# EAGLE design tic12400 (EAGLE 9.6.2)
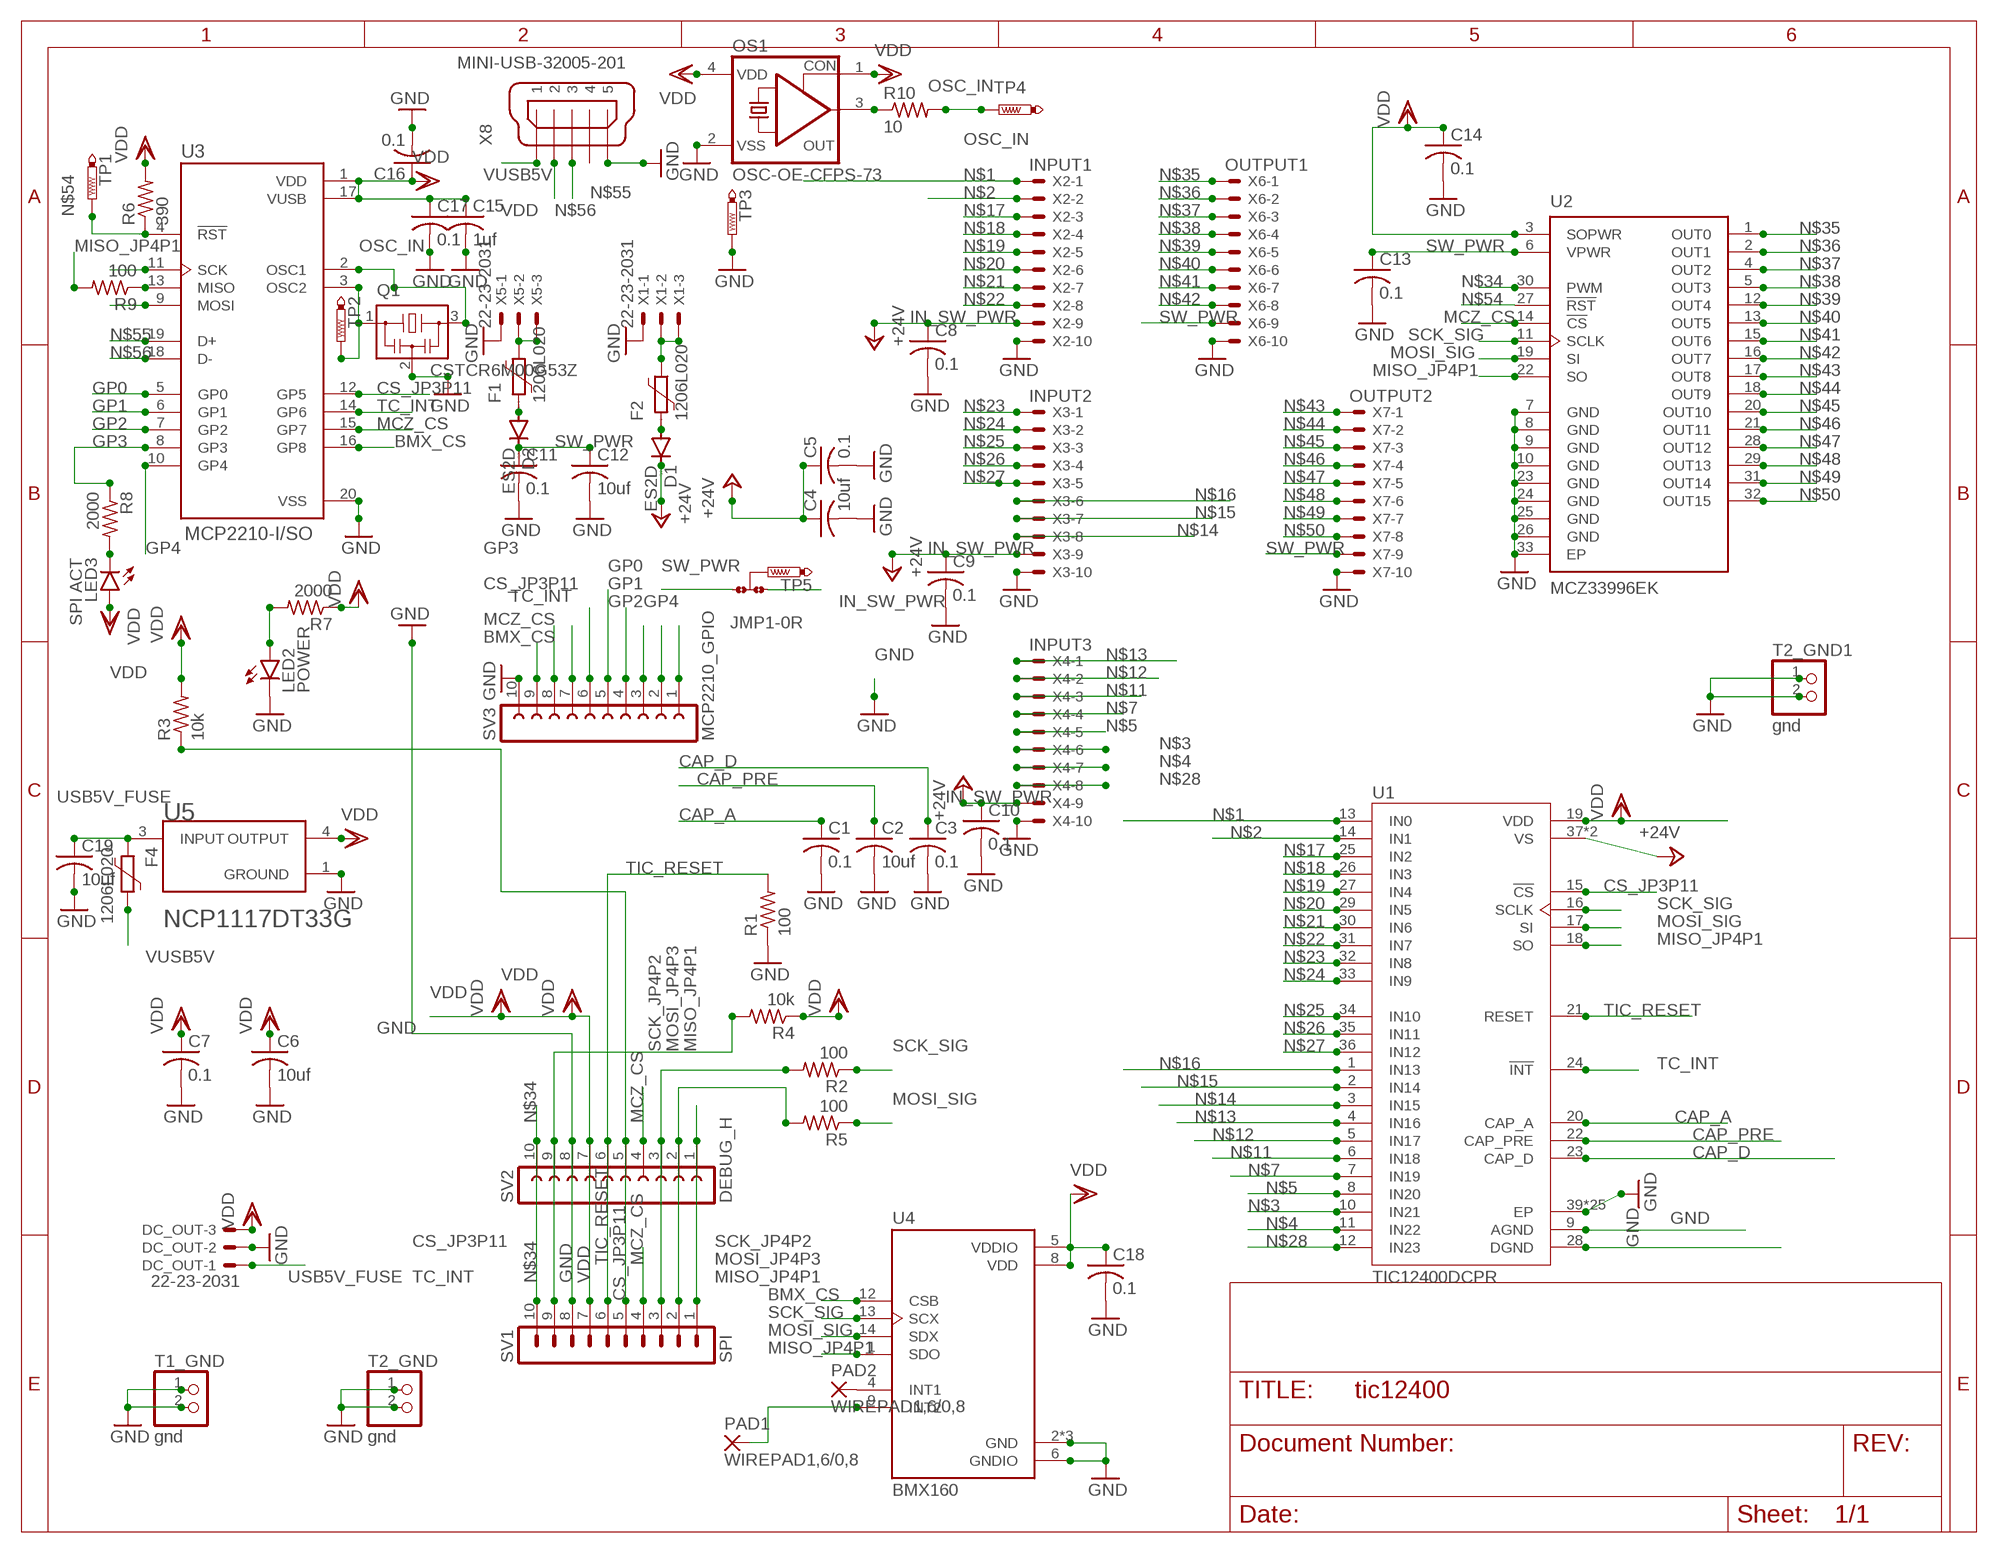
[diagram p0: schematic, sheet 1]

## Parts
C1  0.1  C-USC0805  [C0805]
C2  10uf  C-USC0805  [C0805]
C3  0.1  C-USC0805  [C0805]
C4  10uf  C-USC0805  [C0805]
C5  0.1  C-USC0805  [C0805]
C6  10uf  C-USC0805  [C0805]
C7  0.1  C-USC0805  [C0805]
C8  0.1  C-USC0805  [C0805]
C9  0.1  C-USC0805  [C0805]
C10  0.1  C-USC0805  [C0805]
C11  0.1  C-USC0805  [C0805]
C12  10uf  C-USC0805  [C0805]
C13  0.1  C-USC0805  [C0805]
C14  0.1  C-USC0805  [C0805]
C15  1uf  C-USC0805  [C0805]
C16  0.1  C-USC0805  [C0805]
C17  0.1  C-USC0805  [C0805]
C18  0.1  C-USC0805  [C0805]
C19  10uf  C-USC0805  [C0805]
D1  ES2D  [SMB]
D2  ES2D  [SMB]
DC_OUT  22-23-2031  [22-23-2031]
F1  1206L020  [1206L]
F2  1206L020  [1206L]
F4  1206L020  [1206L]
JMP1  +24_CONNECT  0R-JUMPA  [A0R-JMP]
LED2  POWER  LEDCHIP-LED0805  [CHIP-LED0805]
LED3  SPI ACT  LEDCHIP-LED0805  [CHIP-LED0805]
OS1  OSC-OE-CFPS-73  [7.2X5.2-4-PAD]
PAD1  WIREPAD1,6/0,8  [1,6/0,8]
PAD2  WIREPAD1,6/0,8  [1,6/0,8]
Q1  CSTCR6M00G53Z  [CSTCR6M]
R1  100  R-US_R0805  [R0805]
R2  100  R-US_R0805  [R0805]
R3  10k  R-US_R0805  [R0805]
R4  10k  R-US_R0805  [R0805]
R5  100  R-US_R0805  [R0805]
R6  390  R-US_R0805  [R0805]
R7  2000  R-US_R0805  [R0805]
R8  2000  R-US_R0805  [R0805]
R9  100  R-US_R0805  [R0805]
R10  10  R-US_R0805  [R0805]
SV1  SPI  MA10-1  [MA10-1]
SV2  DEBUG_H  FE10-1  [FE10]
SV3  MCP2210_GPIO  FE10-1  [FE10]
T1_GND  gnd  PINHD-1X2  [1X02]
T2_GND  gnd  PINHD-1X2  [1X02]
T2_GND1  gnd  PINHD-1X2  [1X02]
TP1  PTR1B1,27  [B1,27]
TP2  PTR1B1,27  [B1,27]
TP3  PTR1B1,27  [B1,27]
TP4  PTR1B1,27  [B1,27]
TP5  PTR1B1,27  [B1,27]
U1  TIC12400DCPR  [SOP50P640X120-38N]
U2  MCZ33996EK  [SOP65P1030X265-33N]
U3  MCP2210-I/SO  [SOP65P780X200-20N]
U4  BMX160  [PQFN50P250X300X100-14N]
U5  ON_SEMICONDUCTOR_NCP1117DT33GON_SEMICONDUCTOR_NCP1117DT33G_0_0  [ON_SEMICONDUCTOR_NCP1117DT33G_0]
X1  22-23-2031  [22-23-2031]
X2  INPUT1  KK-156-10  [KK-156-10]
X3  INPUT2  KK-156-10  [KK-156-10]
X4  INPUT3  KK-156-10  [KK-156-10]
X5  22-23-2031  [22-23-2031]
X6  OUTPUT1  KK-156-10  [KK-156-10]
X7  OUTPUT2  KK-156-10  [KK-156-10]
X8  MINI-USB-32005-201  [32005-201]

## Nets
BMX_CS: SV3.9 U3.16(GP8) U4.12(CSB)
CAP_A: C1.1 U1.20(CAP_A)
CAP_D: C3.1 U1.23(CAP_D)
CAP_PRE: C2.1 U1.22(CAP_PRE)
CS_JP3P11: R3.1 SV1.5 SV2.5 SV3.6 U1.15(!CS) U3.12(GP5)
GND [icurrent]: C1.2 C2.2 C3.2 C4.2 C5.2 C6.2 C7.2 C8.2 C9.2 C10.2 C11.2 C12.2 C13.2 C14.2 C15.2 C16.2 C17.2 C18.2 C19.2 DC_OUT.2 LED2.C OS1.2(VSS) Q1.2 R1.1 SV1.8 SV2.8 SV3.10 T1_GND.1 T1_GND.2 T2_GND1.1 T2_GND1.2 T2_GND.1 T2_GND.2 TP3.TP U1.9(AGND) U1.28(DGND) U1.39(EP) U1.40(EP) U1.41(EP) U1.42(EP) U1.43(EP) U1.44(EP) U1.45(EP) U1.46(EP) U1.47(EP) U1.48(EP) U1.49(EP) U1.50(EP) U1.51(EP) U1.52(EP) U1.53(EP) U1.54(EP) U1.55(EP) U1.56(EP) U1.57(EP) U1.58(EP) U1.59(EP) U1.60(EP) U1.61(EP) U1.62(EP) U1.63(EP) U2.7(GND) U2.8(GND) U2.9(GND) U2.10(GND) U2.23(GND) U2.24(GND) U2.25(GND) U2.26(GND) U2.33(EP) U3.20(VSS) U4.2(GND) U4.3(GND) U4.6(GNDIO) U4.7(GND) U5.1(GROUND) X1.1 X2.10 X3.10 X4.10 X5.1 X6.10 X7.10 X8.5
GP0: SV3.1 U3.5(GP0)
GP1: SV3.2 U3.6(GP1)
GP2: SV3.3 U3.7(GP2)
GP3: R8.1 SV3.4 U3.8(GP3)
GP4: SV3.5 U3.10(GP4)
IN_SW_PWR [icurrent]: C4.1 C5.1 C8.1 C9.1 C10.1 D1.C JMP1.3 U1.37(VS) U1.38(VS) X2.9 X3.9 X4.9 ; supply symbol labelled +24V
MCZ_CS: SV1.4 SV2.4 SV3.8 U2.14(!CS) U3.15(GP7)
MISO_JP4P1: R9.2 SV1.1 SV2.1 U1.18(SO) U2.22(SO) U4.1(SDO)
MOSI_JP4P3: R5.2 SV1.2 SV2.2
MOSI_SIG: R5.1 U1.17(SI) U2.19(SI) U3.9(MOSI) U4.14(SDX)
N$1: U1.13(IN0) X2.1
N$2: U1.14(IN1) X2.2
N$3: U1.10(IN21) X4.6
N$4: U1.11(IN22) X4.7
N$5: U1.8(IN20) X4.5
N$7: U1.7(IN19) X4.4
N$11: U1.6(IN18) X4.3
N$12: U1.5(IN17) X4.2
N$13: U1.4(IN16) X4.1
N$14: U1.3(IN15) X3.8
N$15: U1.2(IN14) X3.7
N$16: U1.1(IN13) X3.6
N$17: U1.25(IN2) X2.3
N$18: U1.26(IN3) X2.4
N$19: U1.27(IN4) X2.5
N$20: U1.29(IN5) X2.6
N$21: U1.30(IN6) X2.7
N$22: U1.31(IN7) X2.8
N$23: U1.32(IN8) X3.1
N$24: U1.33(IN9) X3.2
N$25: U1.34(IN10) X3.3
N$26: U1.35(IN11) X3.4
N$27: U1.36(IN12) X3.5
N$28: U1.12(IN23) X4.8
N$29 [icurrent]: F2.1 X1.2 X1.3
N$31 [icurrent]: D2.A F1.2
N$32 [icurrent]: F1.1 X5.2 X5.3
N$34: SV1.10 SV2.10 U2.30(PWM)
N$35 [icurrent]: U2.1(OUT0) X6.1
N$36 [icurrent]: U2.2(OUT1) X6.2
N$37 [icurrent]: U2.4(OUT2) X6.3
N$38 [icurrent]: U2.5(OUT3) X6.4
N$39 [icurrent]: U2.12(OUT4) X6.5
N$40 [icurrent]: U2.13(OUT5) X6.6
N$41 [icurrent]: U2.15(OUT6) X6.7
N$42 [icurrent]: U2.16(OUT7) X6.8
N$43 [icurrent]: U2.17(OUT8) X7.1
N$44 [icurrent]: U2.18(OUT9) X7.2
N$45 [icurrent]: U2.20(OUT10) X7.3
N$46 [icurrent]: U2.21(OUT11) X7.4
N$47 [icurrent]: U2.28(OUT12) X7.5
N$48 [icurrent]: U2.29(OUT13) X7.6
N$49 [icurrent]: U2.31(OUT14) X7.7
N$50 [icurrent]: U2.32(OUT15) X7.8
N$51 [icurrent]: D1.A F2.2
N$53: Q1.1 TP2.TP U3.3(OSC2)
N$54: R6.1 TP1.TP U2.27(!RST) U3.4(!RST)
N$55: U3.19(D+) X8.3
N$56: U3.18(D-) X8.2
N$58: LED2.A R7.2
N$59: LED3.C R8.2
N$66: R9.1 U3.13(MISO)
N$67: OS1.3(OUT) R10.1
N$68: JMP1.2 TP5.TP
N$70: PAD2.1(P) U4.4(INT1)
N$71: PAD1.1(P) U4.9(INT2)
OSC_IN: Q1.3 R10.2 TP4.TP U3.2(OSC1)
SCK_JP4P2: R2.2 SV1.3 SV2.3
SCK_SIG: R2.1 U1.16(SCLK) U2.11(SCLK) U3.11(SCK) U4.13(SCX)
SW_PWR [icurrent]: C11.1 C12.1 C13.1 D2.C JMP1.1 U2.6(VPWR) X6.9 X7.9
TC_INT: R4.2 SV1.9 SV2.9 SV3.7 U1.24(!INT) U3.14(GP6)
TIC_RESET: R1.2 SV1.6 SV2.6 U1.21(RESET)
USB5V_FUSE [icurrent]: C19.1 DC_OUT.1 F4.2 U5.3(INPUT)
VDD [icurrent]: C6.1 C7.1 C14.1 C15.1 C16.1 C17.1 C18.1 DC_OUT.3 LED3.A OS1.1(CON) OS1.4(VDD) R3.2 R4.1 R6.2 R7.1 SV1.7 SV2.7 U1.19(VDD) U2.3(SOPWR) U3.1(VDD) U3.17(VUSB) U4.5(VDDIO) U4.8(VDD) U5.4(OUTPUT)
VUSB5V: F4.1 X8.1
Unconnected: X8.4

## Library data of the parts
C1-C19 = rcl:C-US: CAPACITOR, American symbol; SPICEPREFIX: C
D1 D2 = diode:ES2D: DIODE super fast rectifier, 2 A
DC_OUT X1 X5 = con-molex:22-23-2031: .100" (2.54mm) Center Header - 3 Pin; MF: MOLEX; MPN: 22-23-2031; OC_FARNELL: 1462950; OC_NEWARK: 30C0862
F1 F2 F4 = polyfuse-smd_10:?: Polyfuse Resettable PTC Source: http://www.littelfuse.com/products/resettable-ptcs.aspx; MF: Littelfuse; MPN: 1206L020; OC_FARNELL: 2072173; OC_NEWARK: 05M2300
JMP1 = jump-0r-smd:0R-JUMP: SMD 0R 0805 Jumper
LED2 LED3 = led:LED: LED OSRAM: - CHIPLED LG R971, LG N971, LY N971, LG Q971, LY Q971, LO R971, LY R971 LH N974, LH R974 LS Q976, LO Q976, LY Q976 LO Q996 - Hyper CHIPLED LW Q18S LB Q993, LB Q99A, LB R99A - SideLED LS A670, LO A670, LY A670, LG A670, LP A670 LB A673, LV A673, LT A673, LW A673 LH A674 LY A675 LS A676, LA A676, LO A676, LY A676, LW A676 LS A679, LY A679, LG A679 - Hyper Micro SIDELED® LS Y876, LA Y876, LO Y876, LY Y876 LT Y87S - SmartLED LW L88C, LW L88S LB L89C, LB L89S, LG L890 LS L89K, LO L89K, LY L89K LS L896, LA L896, LO L896, LY L896 - TOPLED LS T670, LO T670, LY T670, LG T670, LP T670 LSG T670, LSP T670, LSY T670, LOP T670, LYG T670 LG T671, LOG T671, LSG T671 LB T673, LV T673, LT T673, LW T673 LH T674 LS T676, LA T676, LO T676, LY T676, LB T676, LH T676, LSB T676, LW T676 LB T67C, LV T67C, LT T67C, LS T67K, LO T67K, LY T67K, LW E67C LS E67B, LA E67B, LO E67B, LY E67B, LB E67C, LV E67C, LT E67C LW T67C LS T679, LY T679, LG T679 LS T770, LO T770, LY T770, LG T770, LP T770 LB T773, LV T773, LT T773, LW T773 LH T774 LS E675, LA E675, LY E675, LS T675 LS T776, LA T776, LO T776, LY T776, LB T776 LHGB T686 LT T68C, LB T68C - Hyper Mini TOPLED® LB M676 - Mini TOPLED Santana® LG M470 LS M47K, LO M47K, LY M47K Source: http://www.osram.convergy.de LUXEON: - LUMILED® LXK2-PW12-R00, LXK2-PW12-S00, LXK2-PW14-U00, LXK2-PW14-V00 LXK2-PM12-R00, LXK2-PM12-S00, LXK2-PM14-U00 LXK2-PE12-Q00, LXK2-PE12-R00, LXK2-PE12-S00, LXK2-PE14-T00, LXK2-PE14-U00 LXK2-PB12-K00, LXK2-PB12-L00, LXK2-PB12-M00, LXK2-PB14-N00, LXK2-PB14-P00, LXK2-PB14-Q00 LXK2-PR12-L00, LXK2-PR12-M00, LXK2-PR14-Q00, LXK2-PR14-R00 LXK2-PD12-Q00, LXK2-PD12-R00, LXK2-PD12-S00 LXK2-PH12-R00, LXK2-PH12-S00 LXK2-PL12-P00, LXK2-PL12-Q00, LXK2-PL12-R00 Source: www.luxeon.com KINGBRIGHT: KA-3528ASYC Source: www.kingbright.com
OS1 = IQD-Frequency-Products:OSC-OE: OSCILLATOR WITH OE
PAD1 PAD2 = wirepad:WIREPAD: Wire PAD connect wire on PCB
Q1 = murata-filter:CSTCR: Resonator Source: murata.co.jp; MPN: CSTCR6M00G53-R0; OC_FARNELL: 1170434; OC_NEWARK: 25M8759
R1-R10 = rcl:R-US_: RESISTOR, American symbol; SPICEPREFIX: R
SV1 = con-lstb:MA10-1: PIN HEADER; OC_FARNELL: unknown; OC_NEWARK: unknown
SV2 SV3 = con-lsta:FE10-1: FEMALE HEADER; OC_FARNELL: unknown; OC_NEWARK: unknown
T1_GND T2_GND T2_GND1 = pinhead:PINHD-1X2: PIN HEADER
TP1-TP5 = testpad:PTR1: TEST PIN
U1 = TIC12400DCPR:TIC12400DCPR: MSDI- PRODUCTION- COMMERCIAL VER; DESCRIPTION: 24-input sensor monitor with integrated 1:1 (SPST), 10-channel ADC & SPI 38-HTSSOP -40 to 105; DIGI-KEY_PART_NUMBER: 296-47492-1-ND; MF: Texas Instruments; MP: TIC12400DCPR; PACKAGE: HTSSOP-38 Texas Instruments; PURCHASE-URL: https://pricing.snapeda.com/search/part/TIC12400DCPR/?ref=eda
U2 = MCZ33996EK:MCZ33996EK: Power Switch Lo Side 0.9A Automotive 32-Pin SOIC W EP Tube Check prices <https://pricing.snapeda.com/parts/MCZ33996EK/NXP%20USA/view-part?ref=eda>; AVAILABILITY: In Stock; DESCRIPTION: Power Switch/Driver 1:16 N-Channel 900mA 32-SOIC-EP; MF: NXP USA; MP: MCZ33996EK; PACKAGE: SOIC-32 NXP Semiconductors; PRICE: None
U3 = MCP2210-I_SO:MCP2210-I/SO: MCP2210 Series 5.5 V 8 Channel USB to SPI Protocol Converter SMT - SSOP-20 Check prices <https://pricing.snapeda.com/parts/MCP2210-I/SO/Microchip%20Technology/view-part?ref=eda>; DESCRIPTION: USB to SPI Protocol Converter with GPIO SPI Interface 5V Automotive 20-Pin SOIC W Tube; MF: Microchip Technology; MP: MCP2210-I/SO; PACKAGE: None; PRICE: None
U4 = BMX160:BMX160: IMU ACCEL/GYRO/MAG Check prices <https://pricing.snapeda.com/parts/BMX160/Bosch%20Sensortec/view-part?ref=eda>; AVAILABILITY: Good; DESCRIPTION: Accelerometer, Gyroscope, Magnetometer, 9 Axis Sensor I²C, SPI Output; MF: Bosch Sensortec; MP: BMX160; PACKAGE: VFLGA-14 Bosch Sensortec; PRICE: None; PURCHASE-URL: https://pricing.snapeda.com/search/part/BMX160/?ref=eda
U5 = ON Semiconductor - NCP1117DT33G:ON_SEMICONDUCTOR_NCP1117DT33G: IC REG LINEAR 3.3V 1A DPAK; ACCURACY_PERCENTAGE: 1%; AMBIENT_TEMPERATURE_RANGE_HIGH: +125°C; AMBIENT_TEMPERATURE_RANGE_LOW: 0°C; AUTOMOTIVE: No; CENTROID_NOT_SPECIFIED: No; DATASHEET: https://www.onsemi.jp/PowerSolutions/document/NCP1117-D.PDF; DEVICE_CLASS_L1: Integrated Circuits (ICs); DEVICE_CLASS_L2: Power Management ICs; DEVICE_CLASS_L3: Voltage Regulators - Linear; DIGIKEY_DESCRIPTION: IC REG LINEAR 3.3V 1A DPAK; DIGIKEY_PART_NUMBER: NCP1117DT33GOS-ND; DROPOUT_VOLTAGE: 1.2V; FOOTPRINT_URL: https://www.onsemi.com/pub/Collateral/369C.PDF; FOOTPRINT_VARIANT_NAME_0: Recommended_Land_Pattern; HEIGHT: 2.51mm; LEAD_FREE: Yes; MAX_JUNCTION_TEMP: +150°C; MAX_SUPPLY_VOLTAGE: 20V; MF: ON Semiconductor; MFG_PACKAGE_IDENT: 369C; MFG_PACKAGE_IDENT_DATE: 07/2015; MFG_PACKAGE_IDENT_REV: F; MIN_SUPPLY_VOLTAGE: 2.4V; MOUSER_DESCRIPTION: LDO Voltage Regulators 3.3V 1A Positive; MOUSER_PART_NUMBER: 863-NCP1117DT33G; MPN: NCP1117DT33G; NOMINAL_SUPPLY_CURRENT: 6mA; NUMBER_OF_OUTPUTS: 1; OUTPUT_CURRENT: 1A; OUTPUT_TYPE: Fixed; OUTPUT_VOLTAGE: 3.3V; PACKAGE: DPAK; PREFIX: U; ROHS: Yes; STANDOFF_HEIGHT: 0mm; TEMPERATURE_RANGE_HIGH: +150°C; TEMPERATURE_RANGE_LOW: -55°C; VERIFICATION_VERSION: 0.0.0.3
X2-X4 X6 X7 = con-molex:KK-156-10: KK 156 HEADER Source: http://www.molex.com/pdm_docs/sd/026604100_sd.pdf; MF: MOLEX; OC_FARNELL: unknown; OC_NEWARK: unknown
X8 = con-cypressindustries:MINI-USB-: MINI USB-B Conector Source: www.cypressindustries.com; OC_FARNELL: unknown; OC_NEWARK: unknown

## Net classes
1 icurrent: width 0.254 mm

## Board
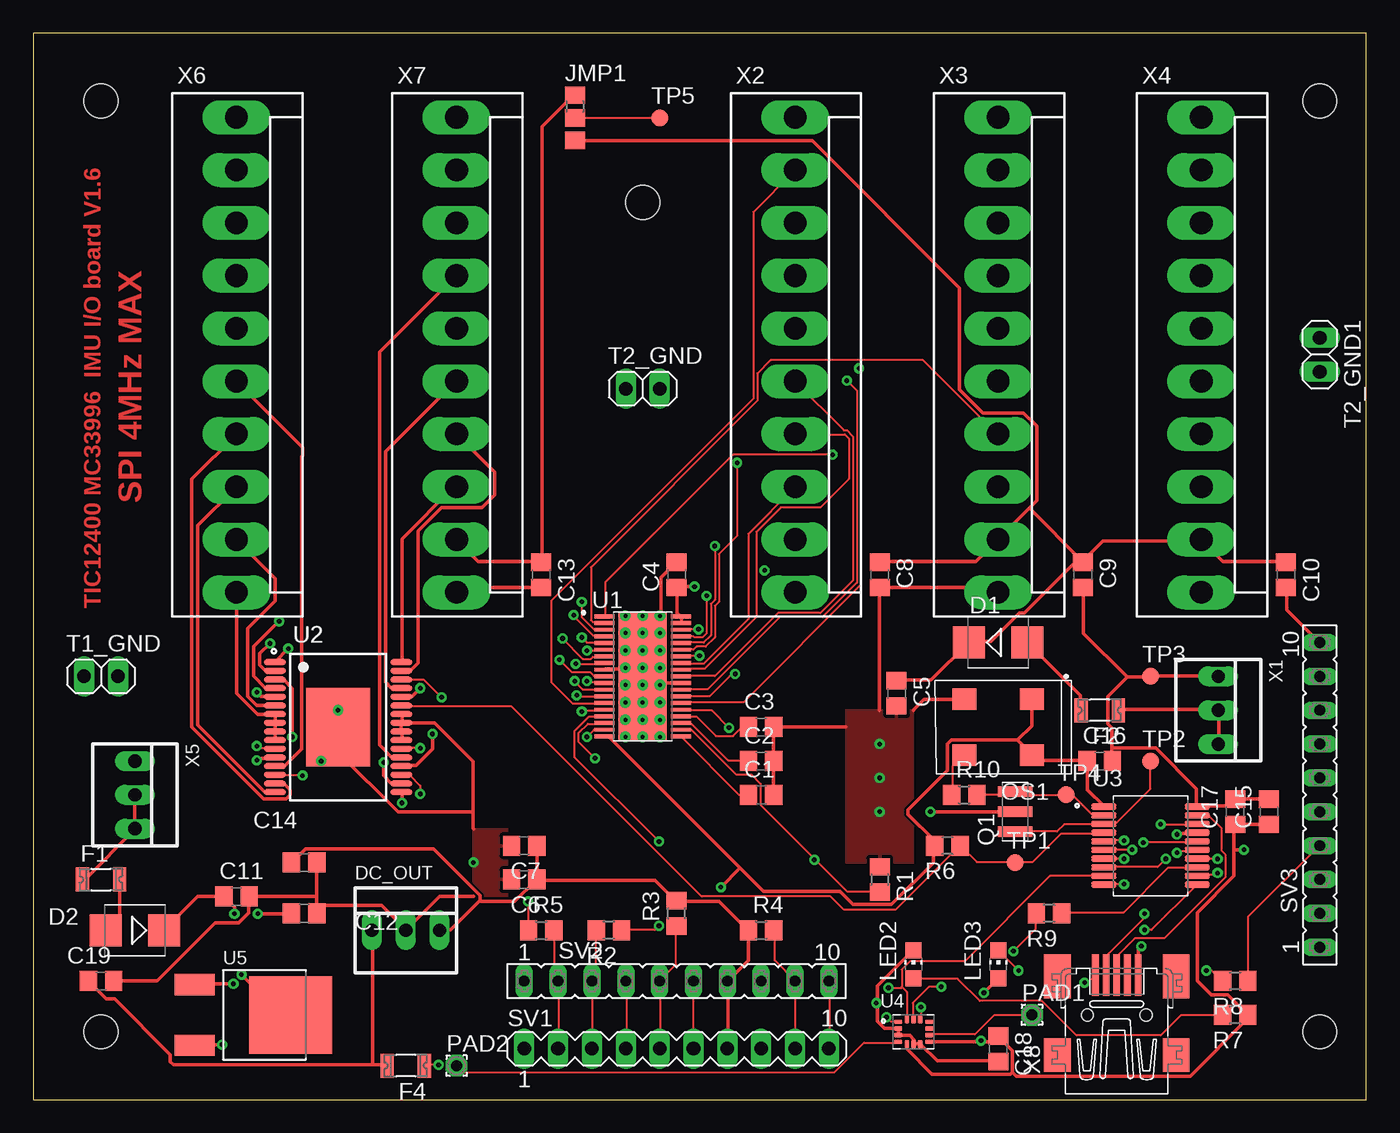
[diagram p1: board, top side]
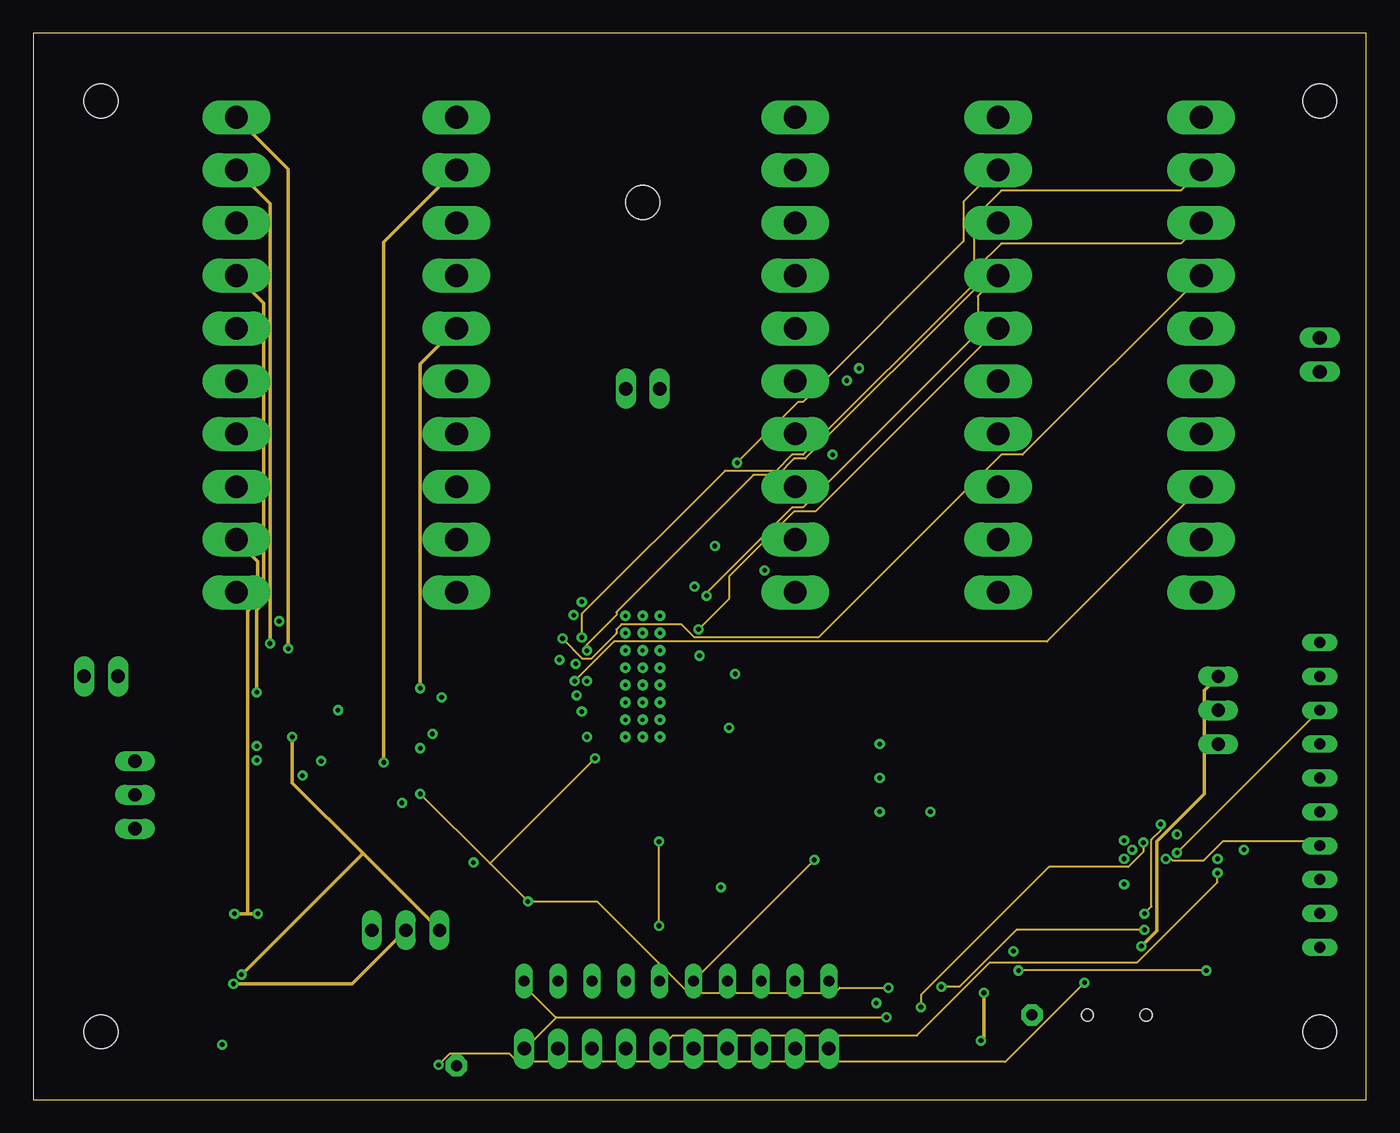
[diagram p2: board, inner layer Route2]
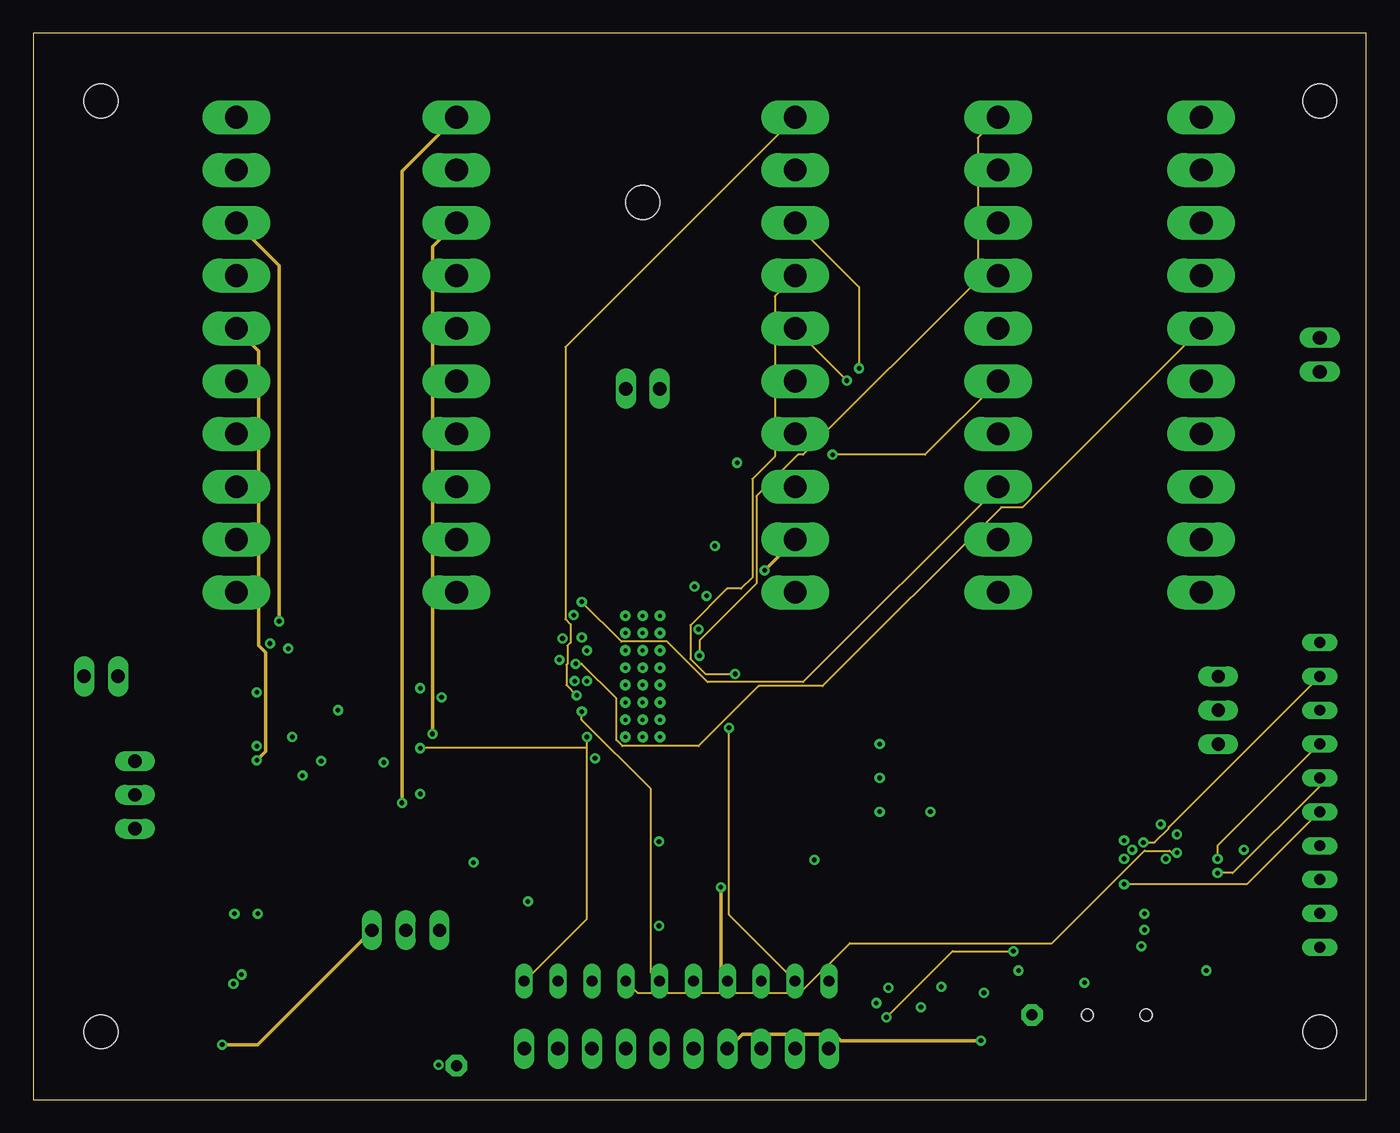
[diagram p3: board, inner layer Route15]
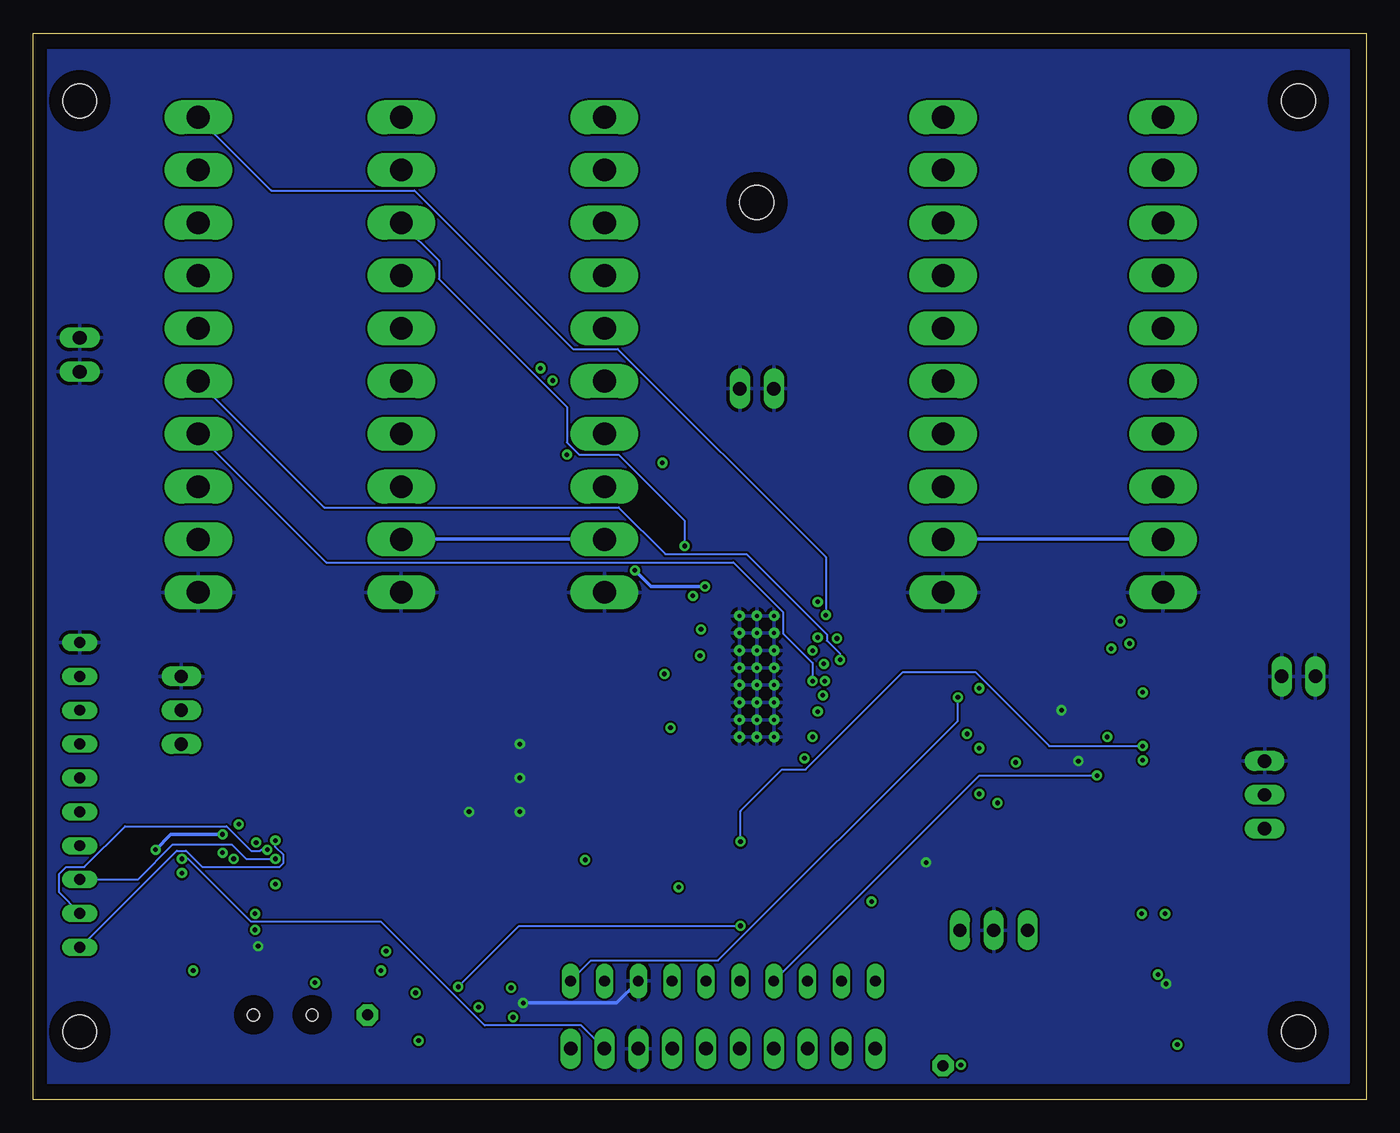
[diagram p4: board, bottom side, seen from below]

Size 100 x 80 mm. Coordinates in mm from the lower left corner, seen from the top.
Outline: 0,0 100,0 100,80 0,80 0,0
Copper layers (1+2*15+16): Top 0.035mm / dielectric 1.5mm / Route2 0.035mm / dielectric 0.15mm / Route15 0.035mm / dielectric 0.2mm / Bottom 0.035mm
Design rules "default *": minimum track width 6mil, minimum drill 0.35mm, track to track 6mil, track to pad 6mil, pad to pad 6mil, via to via 6mil, smd to smd 6mil, copper to edge 40mil, drill to drill 6mil, minimum pad ring 10mil, minimum via ring 8mil, stop-mask expansion 4mil, vias tented up to drill 0mil, thermal gap 10mil
Holes 2.54 mm at 5.08,74.93 5.08,5.08 96.52,5.08 96.52,74.93 45.72,67.31

### Footprints (pad centres in the part's own frame; a part is rotated, then mirrored left to right if it is on the bottom)
C0805 = smd 1.3 x 1.5: 1 -0.95,0; 2 0.95,0
SMB = smd 2.4 x 2.4: A 2.2,0; C -2.2,0
22-23-2031 = drill 1 long: 1 -2.54,0; 2 0,0; 3 2.54,0
1206L = smd 1 x 1.8: 1 -1.4,0; 2 1.4,0
A0R-JMP = smd 1.5 x 1.3: 1 0,1.7; 2 0,0; 3 0,-1.7
CHIP-LED0805 = smd 1.2 x 1.2: A 0,-1.05; C 0,1.05
7.2X5.2-4-PAD = smd 1.8 x 1.6: 1 -2.54,-2.1; 2 2.54,-2.1; 3 2.54,2.1; 4 -2.54,2.1
1,6/0,8 = drill 0.813 pad 1.6 octagon: 1 0,0
CSTCR6M = smd 0.8 x 2.6: 1 -1.5,0; 2 0,0; 3 1.5,0
R0805 = smd 1.3 x 1.5: 1 -0.95,0; 2 0.95,0
MA10-1 = drill 1.016 long: 1 -11.43,0; 2 -8.89,0; 3 -6.35,0; 4 -3.81,0; 5 -1.27,0; 6 1.27,0; 7 3.81,0; 8 6.35,0; 9 8.89,0; 10 11.43,0
FE10 = drill 0.813 long: 1 -11.43,0; 2 -8.89,0; 3 -6.35,0; 4 -3.81,0; 5 -1.27,0; 6 1.27,0; 7 3.81,0; 8 6.35,0; 9 8.89,0; 10 11.43,0
1X02 = drill 1.016 long: 1 -1.27,0; 2 1.27,0
B1,27 = smd 1.27 x 1.27: TP 0,0
SOP50P640X120-38N = smd 1.57 x 0.28: 1 -2.87,4.5; 2 -2.87,4; 3 -2.87,3.5; 4 -2.87,3; 5 -2.87,2.5; 6 -2.87,2; 7 -2.87,1.5; 8 -2.87,1; 9 -2.87,0.5; 10 -2.87,0; 11 -2.87,-0.5; 12 -2.87,-1; 13 -2.87,-1.5; 14 -2.87,-2; 15 -2.87,-2.5; 16 -2.87,-3; 17 -2.87,-3.5; 18 -2.87,-4; 19 -2.87,-4.5; 20 2.87,-4.5; 21 2.87,-4; 22 2.87,-3.5; 23 2.87,-3; 24 2.87,-2.5; 25 2.87,-2; 26 2.87,-1.5; 27 2.87,-1; 28 2.87,-0.5; 29 2.87,0; 30 2.87,0.5; 31 2.87,1; 32 2.87,1.5; 33 2.87,2; 34 2.87,2.5; 35 2.87,3; 36 2.87,3.5; 37 2.87,4; 38 2.87,4.5 | smd 3.6 x 9.7: 39 0,0 | drill 0.3 pad 0.5: 40 -1.3,4.55; 41 0,4.55; 42 1.3,4.55; 43 -1.3,3.25; 44 0,3.25; 45 1.3,3.25; 46 -1.3,1.95; 47 0,1.95; 48 1.3,1.95; 49 -1.3,0.65; 50 0,0.65; 51 1.3,0.65; 52 -1.3,-0.65; 53 0,-0.65; 54 1.3,-0.65; 55 -1.3,-1.95; 56 0,-1.95; 57 1.3,-1.95; 58 -1.3,-3.25; 59 -1.3,-4.55; 60 0,-3.25; 61 0,-4.55; 62 1.3,-3.25; 63 1.3,-4.55
SOP65P1030X265-33N = smd 1.65 x 0.45: 1 -4.75,4.875; 2 -4.75,4.225; 3 -4.75,3.575; 4 -4.75,2.925; 5 -4.75,2.275; 6 -4.75,1.625; 7 -4.75,0.975; 8 -4.75,0.325; 9 -4.75,-0.325; 10 -4.75,-0.975; 11 -4.75,-1.625; 12 -4.75,-2.275; 13 -4.75,-2.925; 14 -4.75,-3.575; 15 -4.75,-4.225; 16 -4.75,-4.875; 17 4.75,-4.875; 18 4.75,-4.225; 19 4.75,-3.575; 20 4.75,-2.925; 21 4.75,-2.275; 22 4.75,-1.625; 23 4.75,-0.975; 24 4.75,-0.325; 25 4.75,0.325; 26 4.75,0.975; 27 4.75,1.625; 28 4.75,2.275; 29 4.75,2.925; 30 4.75,3.575; 31 4.75,4.225; 32 4.75,4.875 | smd 4.8 x 5.9: 33 0,0
SOP65P780X200-20N = smd 1.9 x 0.48: 1 -3.505,2.925; 2 -3.505,2.275; 3 -3.505,1.625; 4 -3.505,0.975; 5 -3.505,0.325; 6 -3.505,-0.325; 7 -3.505,-0.975; 8 -3.505,-1.625; 9 -3.505,-2.275; 10 -3.505,-2.925; 11 3.505,-2.925; 12 3.505,-2.275; 13 3.505,-1.625; 14 3.505,-0.975; 15 3.505,-0.325; 16 3.505,0.325; 17 3.505,0.975; 18 3.505,1.625; 19 3.505,2.275; 20 3.505,2.925
PQFN50P250X300X100-14N = smd 0.58 x 0.35: 1 -1.16,0.75; 2 -1.16,0.25; 3 -1.16,-0.25; 4 -1.16,-0.75; 8 1.16,-0.75; 9 1.16,-0.25; 10 1.16,0.25; 11 1.16,0.75 | smd 0.35 x 0.58: 5 -0.5,-0.91; 6 0,-0.91; 7 0.5,-0.91; 12 0.5,0.91; 13 0,0.91; 14 -0.5,0.91
ON_SEMICONDUCTOR_NCP1117DT33G_0 = smd 1.6 x 3: 1 -2.285,-4.39; 3 2.285,-4.39 | smd 5.8 x 6.2: 4 0,2.79
KK-156-10 = drill 1.7 pad 2.184 long: 1 -17.82,0; 2 -13.86,0; 3 -9.9,0; 4 -5.94,0; 5 -1.98,0; 6 1.98,0; 7 5.94,0; 8 9.9,0; 9 13.86,0; 10 17.82,0
32005-201 = smd 3.1 x 0.5: 1 3,1.6; 2 3,0.8; 3 3,0; 4 3,-0.8; 5 3,-1.6 | smd 2.5 x 2: M1 -3,-4.45; M2 -3,4.45 | smd 3.3 x 2: M3 2.9,4.45; M4 2.9,-4.45 | hole 0.9: 0,2.2; 0,-2.2

### Placement (x,y rotation side)
C1  54.61,22.86 0 top
C2  54.61,25.4 0 top
C3  54.61,27.94 0 top
C4  48.26,39.37 90 top
C5  64.77,30.48 270 top
C6  36.83,16.51 180 top
C7  36.83,19.05 180 top
C8  63.5,39.37 270 top
C9  78.74,39.37 270 top
C10  93.98,39.37 270 top
C11  15.24,15.24 0 top
C12  20.32,13.97 0 top
C13  38.1,39.37 270 top
C14  20.32,17.78 0 top
C15  92.71,21.59 90 top
C16  80.01,25.4 0 top
C17  90.17,21.59 90 top
C18  72.39,3.81 270 top
C19  5.08,8.89 0 top
D1  72.39,34.29 0 top
D2  7.62,12.7 180 top
DC_OUT  27.94,12.7 0 top
F1  5.08,16.51 0 top
F2  80.01,29.21 180 top
F4  27.94,2.54 180 top
JMP1  40.64,73.66 0 top
LED2  66.04,10.16 0 top
LED3  72.39,10.16 0 top
OS1  72.39,27.94 180 top
PAD1  74.93,6.35 0 top
PAD2  31.75,2.54 0 top
Q1  73.66,21.59 90 top
R1  63.5,16.51 270 top
R2  43.18,12.7 180 top
R3  48.26,13.97 90 top
R4  54.61,12.7 0 top
R5  38.1,12.7 0 top
R6  68.58,19.05 180 top
R7  90.17,6.35 180 top
R8  90.17,8.89 180 top
R9  76.2,13.97 180 top
R10  69.85,22.86 0 top
SV1  48.26,3.81 0 top
SV2  48.26,8.89 0 top
SV3  96.52,22.86 90 top
T1_GND  5.08,31.75 0 top
T2_GND  45.72,53.34 0 top
T2_GND1  96.52,55.88 270 top
TP1  73.66,17.78 0 top
TP2  83.82,25.4 0 top
TP3  83.82,31.75 0 top
TP4  77.47,22.86 0 top
TP5  46.99,73.66 0 top
U1  45.72,31.75 0 top
U2  22.86,27.94 0 top
U3  83.82,19.05 0 top
U4  66.04,5.08 0 top
U5  16.51,6.35 270 top
X1  88.9,29.21 270 top
X2  57.15,55.88 270 top
X3  72.39,55.88 270 top
X4  87.63,55.88 270 top
X5  7.62,22.86 270 top
X6  15.24,55.88 270 top
X7  31.75,55.88 270 top
X8  81.28,6.35 90 top

### Tracks (layer width: path | path; a pad name or v marks a point on that pad's centre or on a via)
BMX_CS  (via drill 0.35)
  Top 0.152: v66.6,6.93 66.6,6.02 U4.12 | v83.29,19.28 87.17,19.28 87.25,19.36 U3.16
  Route2 0.152: v66.6,6.93 66.6,7.85 76.2,17.45 82.14,17.45 83.29,18.59 v83.29,19.28
  Route15 0.152: SV3.9 85.19,20.42 85.19,20.34 84.12,19.28 v83.29,19.28
CAP_A
  Top 0.152: C1.1 52.96,22.86 48.62,27.2 U1.20
CAP_D
  Top 0.152: C3.1 53.65,27.89 53.11,27.89 52.5,27.28 51.21,27.28 49.76,28.73 48.62,28.73 U1.23
CAP_PRE
  Top 0.152: C2.1 53.65,25.45 52.12,25.45 49.38,28.19 48.62,28.19 U1.22
CS_JP3P11  (via drill 0.35)
  Top 0.152: v88.85,16.99 88.7,16.84 87.33,16.84 U3.12 | R3.1 48.23,12.95 48.23,10.13 SV2.5 47.02,8.84 47.02,3.81 SV1.5 | v41.15,29.11 41.22,29.18 42.82,29.18 U1.15
  Route2 0.152: v88.85,16.99 88.85,16.31 82.83,10.29 71.78,10.29 66.29,4.8 48.01,4.8 47.02,3.81 SV1.5
  Route15 0.152: v88.85,16.99 89.99,16.99 96.47,23.47 96.47,24.08 SV3.6 | v41.15,29.11 41.15,28.5 46.33,23.32 46.33,9.53 46.94,8.91 SV2.5
GND  (via drill 0.35)
  Top 0.254: C1.2 55.55,25.38 C2.2 55.55,25.53 55.55,27.89 C3.2 55.63,27.96 60.96,27.96 | OS1.2 69.8,30.02 66.83,30.02 66.06,29.26 66.04,29.21 | 73.61,21.57 Q1.2 v67.31,21.59 | 21.26,15.24 21.26,17.75 C14.2 | 21.26,15.24 21.26,14.02 C12.2 21.34,14.55 26.14,14.55 27.89,12.8 DC_OUT.2 30.48,15.24 33.02,15.24 | C19.2 6.1,8.91 9.3,8.91 13.64,13.26 15.39,13.26 16.15,14.02 16.15,15.24 C11.2 21.26,15.24 | 63.32,7.24 63.32,5.87 63.86,5.33 64.77,5.33 U4.2 64.92,5.26 64.92,4.88 U4.3 65,4.8 65.76,4.8 66.06,4.5 66.06,4.27 U4.6 66.06,4.19 66.52,4.19 U4.7 66.6,4.12 67.82,2.9 72.39,2.9 C18.2 | 63.32,7.24 63.32,8.53 65.99,11.2 LED2.C | U2.23 27.66,26.98 27.66,27.58 U2.24 27.58,27.74 27.58,28.19 U2.25 | U2.26 27.66,28.88 27.66,28.35 U2.25 | 32.99,21.57 32.99,20.34 33.02,20.32 | 32.99,21.57 32.99,25.38 30.1,28.27 27.74,28.27 U2.25 | C15.2 92.66,22.55 90.22,22.55 C17.2 90.07,22.48 89.61,22.02 87.33,22.02 U3.20 87.25,22.1 87.25,23.32 84.2,26.36 80.92,26.36 | U2.10 18.14,26.98 18.14,27.58 U2.9 18.14,27.74 18.14,28.19 U2.8 18.14,28.35 18.14,28.88 U2.7 17.98,28.88 16.84,28.88 15.24,30.48 X6.10 | X1.1 88.85,31.77 83.82,31.77 TP3.TP 83.74,31.7 82.07,31.7 | C13.2 38.1,38.41 32.08,38.41 31.77,38.1 X7.10 | C4.2 48.23,40.31 47.09,39.17 47.09,36.35 U1.42 | X3.10 72.39,38.1 72.08,38.41 63.55,38.41 C8.2 63.48,38.33 63.48,29.21 | 80.92,26.36 80.92,27.89 80.62,28.19 80.62,30.25 82.07,31.7 | 80.92,26.36 80.92,25.45 C16.2 | 82.07,31.7 78.79,34.98 78.79,38.41 C9.2 | C10.2 94.03,38.41 94.03,36.73 96.47,34.29 SV3.10 | U1.9 42.9,32.31 44.27,32.31 44.35,32.38 U1.49 | U1.28 48.54,31.24 47.17,31.24 47.09,31.17 U1.54
  Top 0.254: v15.01,8.69 12.19,8.69 U5.1 | v83.13,11.51 82.91,11.28 82.91,9.37 X8.5 | U2.33 22.86,26.06 27.36,21.57 32.99,21.57 | v63.25,7.24 63.32,7.24 | U1.53 U1.39
  Route2 0.254: v15.01,8.69 23.93,8.69 DC_OUT.2 | v83.13,11.51 84.28,12.65 84.28,19.36 87.86,22.94 87.86,30.71 X1.1
  Bottom 0.254: v63.25,7.24 56.24,7.24 54.63,8.84 SV2.8
  other vias: 33.02,17.78 63.5,26.67 63.5,24.13 63.5,21.59 22.86,29.21 21.59,25.4
  pour Top: 60.96,29.21 60.96,17.78 66.04,17.78 66.04,29.21
  pour Top: 33.02,20.32 35.56,20.32 35.56,15.24 33.02,15.24
  pour Top: 33.02,20.32 35.56,20.32 35.56,15.24 33.02,15.24
  pour Bottom: 1.27,78.74 99.06,78.74 99.06,1.27 1.27,1.27
GP0  (via drill 0.35)
  Top 0.152: v81.84,19.43 80.39,19.43 U3.5
  Bottom 0.152: v81.84,19.43 81.84,18.97 81.23,18.36 81.23,17.75 81.53,17.45 87.33,17.45 88.54,18.67 89.23,18.67 96.47,11.43 SV3.1
GP1  (via drill 0.35)
  Top 0.152: v82.45,18.75 80.39,18.75 U3.6
  Bottom 0.152: v82.45,18.75 82.91,18.75 82.98,18.67 83.67,18.67 85.5,20.5 93.12,20.5 96.16,17.45 97.54,17.45 98.07,16.92 98.07,15.54 96.55,14.02 SV3.2
GP2  (via drill 0.35)
  Top 0.152: v81.84,18.06 80.39,18.06 U3.7
  Bottom 0.152: v81.84,18.06 84.05,18.06 85.11,19.13 89.53,19.13 92.13,16.54 96.47,16.54 SV3.3
GP3  (via drill 0.35)
  Top 0.152: R8.1 91.14,8.91 91.14,13.72 96.47,19.05 SV3.4 | v84.96,18.06 84.35,17.45 80.39,17.45 U3.8
  Route2 0.152: v84.96,18.06 85.34,18.06 85.5,17.91 87.78,17.91 89.23,19.36 96.16,19.36 96.47,19.05 SV3.4
GP4  (via drill 0.35)
  Top 0.152: v81.84,16.15 80.39,16.15 U3.10
  Route15 0.152: v81.84,16.15 91.06,16.15 96.47,21.57 SV3.5
IN_SW_PWR  (via drill 0.35)
  Top 0.254: U1.37 48.62,35.81 48.62,36.2 U1.38 48.54,36.27 48.31,36.5 48.31,38.41 C4.1 48.39,38.48 v49.61,38.48 | C10.1 93.95,40.39 89.23,40.39 87.63,41.99 X4.9 87.55,41.91 80.24,41.91 78.79,40.46 C9.1 | C5.1 64.77,31.47 67.36,31.47 D1.C 70.26,34.37 71.86,34.37 73.99,36.5 74.37,36.5 78.41,40.54 C9.1 | 74.71,44.39 72.39,42.06 X3.9 72.31,41.99 70.71,40.39 63.55,40.39 C8.1 | 74.71,44.39 75.29,44.96 75.29,50.52 74.3,51.51 71.25,51.51 69.49,53.26 69.49,60.88 58.45,71.93 40.69,71.93 JMP1.3 | 74.71,44.39 78.72,40.39 C9.1
  Route15 0.254: v54.86,39.7 57.15,41.99 X2.9
  Bottom 0.254: v49.61,38.48 53.65,38.48 v54.86,39.7 | X2.9 57.15,42.06 72.39,42.06 X3.9
MCZ_CS  (via drill 0.35)
  Top 0.152: v85.8,18.52 85.95,18.67 87.25,18.67 U3.15 | v20.19,24.31 18.14,24.31 U2.14 | SV1.4 44.5,3.81 44.5,8.84 SV2.4
  Route2 0.152: v85.8,18.52 96.47,29.18 SV3.8
  Route15 0.152: v85.8,18.52 85.42,18.52 85.27,18.67 83.36,18.67 76.43,11.73 61.27,11.73 57.53,8 45.34,8 SV2.4
  Bottom 0.152: v20.19,24.31 29.03,24.31 SV2.4
MISO_JP4P1  (via drill 0.35)
  Top 0.152: v41.53,27.2 42.06,27.74 42.82,27.74 U1.18 | v29.03,26.36 27.66,26.36 U2.22 | v64.01,6.17 64.31,5.87 64.85,5.87 U4.1 | v73.53,11.12 75.21,12.8 75.21,13.95 R9.2
  Route2 0.152: v64.01,6.17 39.24,6.17 39.2,6.13 | 39.2,6.13 36.88,3.81 SV1.1 | 39.2,6.13 36.88,8.46 36.88,8.84 SV2.1
  Route15 0.152: 41.53,26.36 41.53,13.56 36.88,8.91 SV2.1 | 41.53,26.36 v41.53,27.2 | 41.53,26.36 v29.03,26.36 | v73.53,11.12 68.96,11.12 v64.01,6.17
MOSI_JP4P3
  Top 0.152: R5.2 39.09,12.65 39.09,9.14 39.32,8.91 SV2.2 39.4,8.84 39.4,3.81 SV1.2
MOSI_SIG  (via drill 0.35)
  Top 0.152: 65.19,8.42 65.15,8.46 65.15,9.75 65.76,10.36 69.88,10.36 76.28,16.76 80.31,16.76 U3.9 | 65.19,8.42 65.53,8.08 65.53,6.02 U4.14 | v37.11,14.86 37.11,12.72 R5.1 | v29.03,22.94 29.03,23.55 28.27,24.31 27.66,24.31 U2.19 | v42.14,25.6 40.92,26.82 40.92,27.51 41.6,28.19 42.82,28.19 U1.17 | v64.16,8.38 65.15,8.38 65.19,8.42
  Route2 0.152: v29.03,22.94 34.25,17.72 | 34.25,17.72 v37.11,14.86 42.29,14.86 49.15,8 60.12,8 60.5,8.38 v64.16,8.38 | 34.25,17.72 v42.14,25.6
N$1  (via drill 0.35)
  Top 0.152: v40.77,30.33 40.84,30.25 42.82,30.25 U1.13
  Route15 0.152: v40.77,30.33 40.01,31.09 40.01,32.61 40.08,32.69 40.08,34.06 40.31,34.29 40.31,35.66 39.93,36.04 39.93,56.46 57.15,73.69 X2.1
N$2
  Top 0.152: U1.14 42.82,29.72 40.46,29.72 38.86,31.32 38.86,37.41 54.03,52.58 54.03,66.6 57.15,69.72 X2.2
N$3  (via drill 0.35)
  Top 0.152: v39.47,32.99 40.39,32.08 41.76,32.08 42.06,31.77 42.82,31.77 U1.10
  Bottom 0.152: v39.47,32.99 39.47,33.45 40.46,34.44 40.46,34.9 46.48,40.92 52.58,40.92 56.08,44.42 78.18,44.42 87.63,53.87 X4.6
N$4  (via drill 0.35)
  Top 0.152: v41.53,31.39 41.6,31.32 42.82,31.32 U1.11
  Bottom 0.152: v41.53,31.39 41.53,32.77 43.74,34.98 43.74,36.58 47.47,40.31 78.03,40.31 87.63,49.91 X4.7
N$5  (via drill 0.35)
  Top 0.152: v40.69,32.69 42.82,32.69 U1.8
  Route15 0.152: v40.69,32.69 41.15,32.69 43.74,30.1 43.74,26.98 44.2,26.52 49.91,26.52 54.41,31.01 59.21,31.01 72.62,44.42 74.22,44.42 87.63,57.84 X4.5
N$7  (via drill 0.35)
  Top 0.152: v39.7,34.59 41.22,33.07 41.83,33.07 41.99,33.22 42.82,33.22 U1.7
  Route2 0.152: v39.7,34.59 41.22,33.07 41.83,33.07 43.74,34.98 43.74,35.28 44.12,35.66 48.62,35.66 49.61,34.67 58.9,34.67 72.62,48.39 74.22,48.39 87.63,61.8 X4.4
N$11  (via drill 0.35)
  Top 0.152: v41.53,33.68 42.82,33.68 U1.6
  Route2 0.152: v41.53,33.68 41.53,34.14 43.74,36.35 43.74,36.58 54.03,46.86 55.85,46.86 57.07,48.08 57.91,48.08 70.87,61.04 70.87,62.48 72.62,64.24 86.11,64.24 87.63,65.76 X4.3
N$12  (via drill 0.35)
  Top 0.152: v41.15,34.67 41.53,34.29 42.82,34.29 U1.5
  Route2 0.152: v41.15,34.67 41.15,36.42 51.89,47.17 55.7,47.17 56.92,48.39 57.76,48.39 70.56,61.19 70.56,66.14 72.62,68.2 86.11,68.2 87.63,69.72 X4.2
N$13  (via drill 0.35)
  Top 0.152: v40.54,36.35 40.54,36.27 41.99,34.82 42.82,34.82 U1.4
  Bottom 0.152: v40.54,36.35 40.54,40.69 56.16,56.31 59.51,56.31 71.4,68.2 82.14,68.2 87.63,73.69 X4.1
N$14  (via drill 0.35)
  Top 0.152: v41.15,37.34 41.15,36.2 42.06,35.28 42.82,35.28 U1.3
  Route15 0.152: v41.15,37.34 44.12,34.37 47.55,34.37 50.6,31.32 57.76,31.32 72.39,45.95 X3.8
N$15
  Top 0.152: U1.2 42.82,35.81 41.99,35.81 41.83,35.97 41.83,39.93 54.33,52.43 54.33,54.48 55.32,55.47 66.75,55.47 72.24,49.99 72.39,49.99 X3.7
N$16  (via drill 0.35)
  Top 0.152: v59.97,48.39 52.5,48.39 42.9,38.79 42.9,36.27 U1.1
  Route15 0.152: v59.97,48.39 66.9,48.39 72.39,53.87 X3.6
N$17  (via drill 0.35)
  Top 0.152: v61.95,54.86 62.1,54.71 62.1,38.63 53.26,29.79 48.62,29.79 U1.25
  Route15 0.152: v61.95,54.86 61.95,60.96 57.15,65.76 X2.3
N$18  (via drill 0.35)
  Top 0.152: v52.65,31.93 52.43,31.93 50.75,30.25 48.62,30.25 U1.26
  Route15 0.152: v52.65,31.93 50.44,31.93 49.3,33.07 49.3,35.59 52.05,38.33 53.11,38.33 53.95,39.17 53.95,46.56 55.63,48.23 55.63,60.27 57.15,61.8 X2.4
N$19  (via drill 0.35)
  Top 0.152: v61.04,53.95 61.8,53.19 61.8,38.79 59.21,36.2 56.01,36.2 50.6,30.79 48.62,30.79 U1.27
  Route15 0.152: v61.04,53.95 57.15,57.84 X2.5
N$20
  Top 0.152: U1.29 48.62,31.77 51.13,31.77 55.85,36.5 59.05,36.5 61.49,38.94 61.49,49.76 61.04,50.22 60.81,50.22 57.15,53.87 X2.6
N$21
  Top 0.152: U1.30 48.62,32.31 50.37,32.31 54.25,36.2 54.25,42.6 56.08,44.42 59.05,44.42 61.19,46.56 61.19,49.61 60.88,49.91 57.15,49.91 X2.7
N$22
  Top 0.152: U1.31 48.62,32.69 50.29,32.69 53.65,36.04 53.65,42.44 57.15,45.95 X2.8
N$23  (via drill 0.35)
  Top 0.152: v49.99,33.3 48.62,33.3 U1.32
  Route15 0.152: v49.99,33.3 49.99,34.44 54.25,38.71 54.25,45.26 57.38,48.39 57.76,48.39 70.87,61.49 70.87,72.16 72.39,73.69 X3.1
N$24  (via drill 0.35)
  Top 0.152: v52.81,47.78 52.81,42.29 51.44,40.92 51.44,37.34 51.13,37.03 51.13,34.67 50.44,33.98 49.76,33.98 49.53,33.76 48.62,33.76 U1.33
  Route2 0.152: v52.81,47.78 57.38,52.35 57.76,52.35 69.8,64.39 69.8,67.36 72.16,69.72 72.39,69.72 X3.2
N$25  (via drill 0.35)
  Top 0.152: v51.13,41.53 51.13,37.49 50.83,37.19 50.83,34.82 50.29,34.29 48.62,34.29 U1.34
  Bottom 0.152: v51.13,41.53 51.13,43.43 56.08,48.39 59.05,48.39 59.97,49.3 59.97,51.97 69.57,61.57 69.57,62.94 72.39,65.76 X3.3
N$26  (via drill 0.35)
  Top 0.152: v50.52,37.8 50.52,34.98 50.22,34.67 49.61,34.67 49.53,34.75 48.62,34.75 U1.35
  Route2 0.152: v50.52,37.8 50.52,38.02 56.92,44.42 57.76,44.42 70.87,57.53 70.87,60.27 72.39,61.8 X3.4
N$27  (via drill 0.35)
  Top 0.152: v49.91,35.28 48.62,35.28 U1.36
  Route2 0.152: v49.91,35.28 52.2,37.57 52.2,39.24 57.07,44.12 58.67,44.12 72.39,57.84 X3.5
N$28  (via drill 0.35)
  Top 0.152: v40.62,31.39 41.22,30.79 42.82,30.79 U1.12
  Route2 0.152: v40.62,31.39 43.59,34.37 76.05,34.37 87.63,45.95 X4.8
N$29
  Top 0.254: F2.1 81.46,29.26 88.85,29.26 X1.2 88.92,29.11 88.92,26.67 X1.3
N$31
  Top 0.254: F1.2 6.48,16.46 6.48,13.72 5.49,12.72 D2.A
N$32
  Top 0.254: F1.1 3.73,16.54 3.89,16.54 7.62,20.27 X5.3 X5.2
N$34  (via drill 0.35)
  Top 0.152: v30.63,30.18 29.34,31.47 27.66,31.47 U2.30 | SV1.10 59.74,3.81 59.74,8.84 SV2.10
  Bottom 0.152: v30.63,30.18 30.63,28.42 48.62,10.44 58.14,10.44 SV2.10
N$35  (via drill 0.35)
  Top 0.254: v19.13,33.83 18.14,32.84 U2.1
  Route2 0.254: v19.13,33.83 19.13,69.8 15.24,73.69 X6.1
N$36  (via drill 0.35)
  Top 0.254: v17.75,34.21 16.99,33.45 16.99,32.61 17.37,32.23 18.06,32.23 U2.2
  Route2 0.254: v17.75,34.21 17.75,67.21 15.24,69.72 X6.2
N$37  (via drill 0.35)
  Top 0.254: v18.44,35.89 16.54,33.98 16.54,31.77 17.37,30.94 18.06,30.94 U2.4
  Route15 0.254: v18.44,35.89 18.44,62.56 15.24,65.76 X6.3
N$38  (via drill 0.35)
  Top 0.254: v16.76,30.56 17.07,30.25 18.06,30.25 U2.5
  Route2 0.254: v16.76,30.56 16.76,36.73 17.3,37.26 17.3,59.74 15.24,61.8 X6.4
N$39  (via drill 0.35)
  Top 0.254: v16.76,25.45 16.92,25.6 18.06,25.6 U2.12
  Route15 0.254: v16.76,25.45 17.45,26.14 17.45,33.53 16.92,34.06 16.92,56.16 15.24,57.84 X6.5
N$40
  Top 0.254: U2.13 18.14,25.07 18.9,25.07 20.12,26.29 20.12,48.23 20.19,48.31 20.19,48.92 15.24,53.87 X6.6
N$41
  Top 0.254: U2.15 18.14,23.7 18.82,23.7 19.28,23.24 19.28,22.86 18.97,22.55 17.3,22.55 11.89,27.96 11.89,46.56 15.24,49.91 X6.7
N$42
  Top 0.254: U2.16 18.06,23.09 17.37,23.09 12.34,28.12 12.34,43.05 15.24,45.95 X6.8
N$43  (via drill 0.35)
  Top 0.254: v27.66,22.25 27.66,23.01 U2.17
  Route15 0.254: v27.66,22.25 27.66,69.65 31.7,73.69 X7.1
N$44  (via drill 0.35)
  Top 0.254: v26.29,25.3 26.29,24.31 26.82,23.77 27.58,23.77 U2.18
  Route2 0.254: v26.29,25.3 26.29,64.31 31.7,69.72 X7.2
N$45  (via drill 0.35)
  Top 0.254: v29.95,27.43 29.95,26.29 28.73,25.07 27.66,25.07 U2.20
  Route15 0.254: v29.95,27.43 29.95,64.01 31.7,65.76 X7.3
N$46
  Top 0.254: U2.21 27.58,25.68 26.9,25.68 25.98,26.59 25.98,56.08 31.7,61.8 X7.4
N$47  (via drill 0.35)
  Top 0.254: v29.03,30.86 28.42,30.25 27.66,30.25 U2.28
  Route2 0.254: v29.03,30.86 29.03,55.17 31.7,57.84 X7.5
N$48
  Top 0.254: U2.29 27.58,30.94 26.82,30.94 26.44,31.32 26.44,48.62 31.7,53.87 X7.6
N$49
  Top 0.254: U2.31 27.66,32.23 28.35,32.23 28.88,32.77 28.88,42.67 30.63,44.42 33.68,44.42 34.59,45.34 34.59,47.09 31.77,49.91 X7.7
N$50
  Top 0.254: U2.32 27.66,32.84 27.66,42.06 31.55,45.95 31.7,45.95 X7.8
N$51
  Top 0.254: F2.2 78.56,29.26 78.56,30.33 D1.A
N$53
  Top 0.152: TP2.TP 83.82,23.32 81.23,20.73 80.39,20.73 U3.3 80.31,20.65 77.34,20.65 76.81,20.12 73.69,20.12 Q1.1
N$54
  Top 0.152: U2.27 27.66,29.49 35.89,29.49 50.14,15.24 59.82,15.24 60.81,14.25 64.69,14.25 69.49,19.05 R6.1 69.57,19.05 70.79,17.83 73.61,17.83 TP1.TP 73.69,17.83 74.98,17.83 77.11,19.96 80.31,19.96 U3.4
N$55
  Top 0.152: U3.19 87.33,21.26 88.24,21.26 89.15,20.34 89.15,18.67 89.46,18.36 89.46,16.69 84.89,12.12 82.68,12.12 81.31,10.74 81.31,9.37 X8.3
N$56  (via drill 0.35)
  Top 0.152: v84.58,20.65 87.25,20.65 U3.18 | v83.36,13.95 83.36,13.64 80.54,10.82 80.54,9.37 X8.2
  Route2 0.152: v84.58,20.65 84.58,20.19 83.9,19.51 83.9,14.48 v83.36,13.95
N$58
  Top 0.152: LED2.A 66.06,9.07 69.34,9.07 71.02,7.39 75.67,7.39 78.26,4.8 84.58,4.8 86.11,6.33 89.15,6.33 R7.2
N$59  (via drill 0.35)
  Top 0.152: v73.91,9.68 LED3.C | v88.01,9.68 88.39,9.68 89.15,8.91 R8.2
  Route2 0.152: v88.01,9.68 v73.91,9.68
N$66
  Top 0.152: R9.1 77.19,14.02 81.76,14.02 85.11,17.37 87.25,17.37 U3.13
N$67
  Top 0.152: R10.1 68.96,22.86 68.96,24.99 69.8,25.83 OS1.3
N$68
  Top 0.152: TP5.TP 46.94,73.69 40.69,73.69 JMP1.2
N$70
  Top 0.152: PAD2.1 32.23,2.06 60.12,2.06 62.33,4.27 64.85,4.27 U4.4
N$71
  Top 0.152: U4.9 67.21,4.88 70.64,4.88 72.08,6.33 74.91,6.33 PAD1.1
OSC_IN
  Top 0.152: U3.2 80.31,21.34 79.48,21.34 77.95,22.86 TP4.TP 73.91,22.86 73.69,23.09 Q1.3 73.61,23.09 73.38,22.86 R10.2
SCK_JP4P2
  Top 0.152: R2.2 42.22,12.65 42.22,9.22 41.91,8.91 SV2.3 SV1.3
SCK_SIG  (via drill 0.35)
  Top 0.152: v68.12,8.46 67.21,8.46 65.99,7.24 65.99,6.02 U4.13 | v83.36,12.72 83.9,12.72 87.25,16.08 U3.11 | v46.94,13.03 46.63,12.72 44.2,12.72 R2.1 | v46.94,19.36 40.62,25.68 40.62,27.66 41.68,28.73 42.82,28.73 U1.16 | v16.76,26.52 16.92,26.36 18.06,26.36 U2.11
  Route2 0.152: v68.12,8.46 69.49,8.46 73.76,12.72 v83.36,12.72 | v46.94,13.03 v46.94,19.36
  Bottom 0.152: v46.94,13.03 63.55,13.03 v68.12,8.46 | v16.76,26.52 23.77,26.52 29.34,32.08 34.75,32.08 42.06,24.77 43.81,24.77 46.94,21.64 v46.94,19.36
SW_PWR  (via drill 0.35)
  Top 0.254: D2.C 9.83,12.72 12.34,15.24 C11.1 14.33,15.16 15.09,14.4 v15.09,13.95 | v16.84,13.95 19.36,13.95 C12.1 | U2.6 18.06,29.57 16.76,29.57 16.08,30.25 16.08,35.36 18.14,37.41 18.14,39.09 15.24,41.99 X6.9 | X7.9 31.77,41.99 33.38,40.39 38.1,40.39 C13.1 38.18,40.46 38.18,73 40.46,75.29 40.62,75.29 JMP1.1
  Route2 0.254: v15.09,13.95 16.08,13.95 | 16.08,13.95 v16.84,13.95 | 16.08,13.95 16.08,36.65 16.84,37.41 16.84,40.39 15.24,41.99 X6.9
  Bottom 0.254: X6.9 15.24,42.06 31.7,42.06 X7.9
TC_INT  (via drill 0.35)
  Top 0.152: v88.85,18.06 U3.14 | R4.2 55.63,12.65 55.63,10.44 57.15,8.91 SV2.9 SV1.9 | v52.2,27.89 50.9,29.18 48.62,29.18 U1.24
  Route15 0.152: v88.85,18.06 88.85,19.05 96.47,26.67 SV3.7 | v52.2,27.89 52.2,13.87 57.15,8.91 SV2.9
  Bottom 0.152: v88.85,18.06 88.39,18.06 83.67,13.34 73.91,13.34 66.14,5.56 58.9,5.56 SV1.9
TIC_RESET  (via drill 0.35)
  Top 0.152: SV1.6 SV2.6 | 58.64,18.02 54.56,22.1 54.56,23.7 53.87,24.38 52.73,24.38 49.38,27.74 48.62,27.74 U1.21 | 58.64,18.02 61.04,15.62 63.48,15.62 R1.2 | v58.6,17.98 58.64,18.02
  Route2 0.152: v58.6,17.98 49.53,8.91 SV2.6
USB5V_FUSE  (via drill 0.35)
  Top 0.254: v14.17,4.12 12.19,4.12 U5.3 | 25.45,2.59 26.52,2.59 F4.2 | 25.45,2.59 10.52,2.59 10.29,2.82 10.29,3.35 6.1,7.54 5.49,7.54 4.19,8.84 C19.1 | 25.45,2.59 25.45,12.65 DC_OUT.1
  Route15 0.254: v14.17,4.12 16.84,4.12 25.38,12.65 DC_OUT.1
VDD  (via drill 0.35)
  Top 0.254: U3.1 80.31,22.02 79.1,23.24 79.1,25.38 C16.1 78.94,25.45 75.44,25.45 75.06,25.83 OS1.4 74.91,25.91 73.84,26.98 | 73.84,26.98 68.89,26.98 68.58,26.67 68.58,24.69 65.61,21.72 65.61,21.41 67.59,19.43 67.59,19.05 R6.2 67.51,18.97 67.51,17.75 64.39,14.63 61.49,14.63 60.5,15.62 54.79,15.62 53.03,17.37 | 53.03,17.37 43.2,27.2 42.9,27.2 U1.19 | 73.84,26.98 74.91,28.04 74.91,30.02 OS1.1 | C6.1 37.8,16.54 37.8,19.05 C7.1 | 33.53,14.94 33.53,15.32 30.02,18.82 20.42,18.82 19.43,17.83 C14.1 | 33.53,14.94 31.32,12.72 30.48,12.72 DC_OUT.3 | v19.43,27.2 19.43,30.86 18.82,31.47 18.14,31.47 U2.3 | C6.1 37.72,16.46 36.12,14.86 33.6,14.86 33.53,14.94 | v15.62,9.37 18.59,6.4 19.28,6.4 U5.4 | C15.1 92.66,20.65 90.22,20.65 C17.1 90.07,20.57 90.07,18.75 | 90.07,18.75 90.07,16.76 87.33,14.02 87.33,8.91 88.39,7.85 89.61,7.85 91.06,6.4 R7.1 91.06,6.25 91.06,6.02 86.79,1.75 73.76,1.75 73.46,2.06 | v85.8,19.89 85.88,19.96 87.25,19.96 U3.17 | 90.07,18.75 v90.83,18.75 | 73.46,2.06 73.3,1.91 67.44,1.91 65.53,3.81 65.53,4.12 U4.5 | 73.46,2.06 73.46,3.66 72.39,4.72 C18.1 72.31,4.65 72.01,4.34 71.09,4.34 | 71.09,4.34 67.21,4.34 U4.8 | v71.32,8 72.39,9.07 LED3.A | v71.09,4.42 71.09,4.34 | SV1.7 52.12,3.81 52.12,8.84 SV2.7 52.12,8.91 53.65,10.44 53.65,12.65 R4.1 53.57,12.72 51.44,14.86 48.31,14.86 R3.2 48.16,14.94 46.63,16.46 37.87,16.46 C6.1 | v51.59,15.93 53.03,17.37
  Route2 0.254: v19.43,27.2 19.43,23.77 24.73,18.48 | 24.73,18.48 30.48,12.72 DC_OUT.3 | 24.73,18.48 v15.62,9.37 | v71.32,8 71.32,4.65 v71.09,4.42
  Route15 0.254: v71.09,4.42 60.58,4.42 60.12,4.88 53.19,4.88 52.12,3.81 SV1.7 | v51.59,15.93 51.59,9.37 SV2.7
  Bottom 0.254: v85.8,19.89 89.69,19.89 v90.83,18.75
VUSB5V  (via drill 0.35)
  Top 0.152: v30.4,2.59 29.41,2.59 F4.1 | v78.87,8.76 79.1,8.76 79.63,9.3 X8.1
  Route2 0.152: v30.4,2.59 31.24,3.43 35.74,3.43 36.35,2.82 72.92,2.82 v78.87,8.76

### Text on the board
Top: SPI 4MHz MAX | TIC12400 MC33996 IMU I/O board V1.6